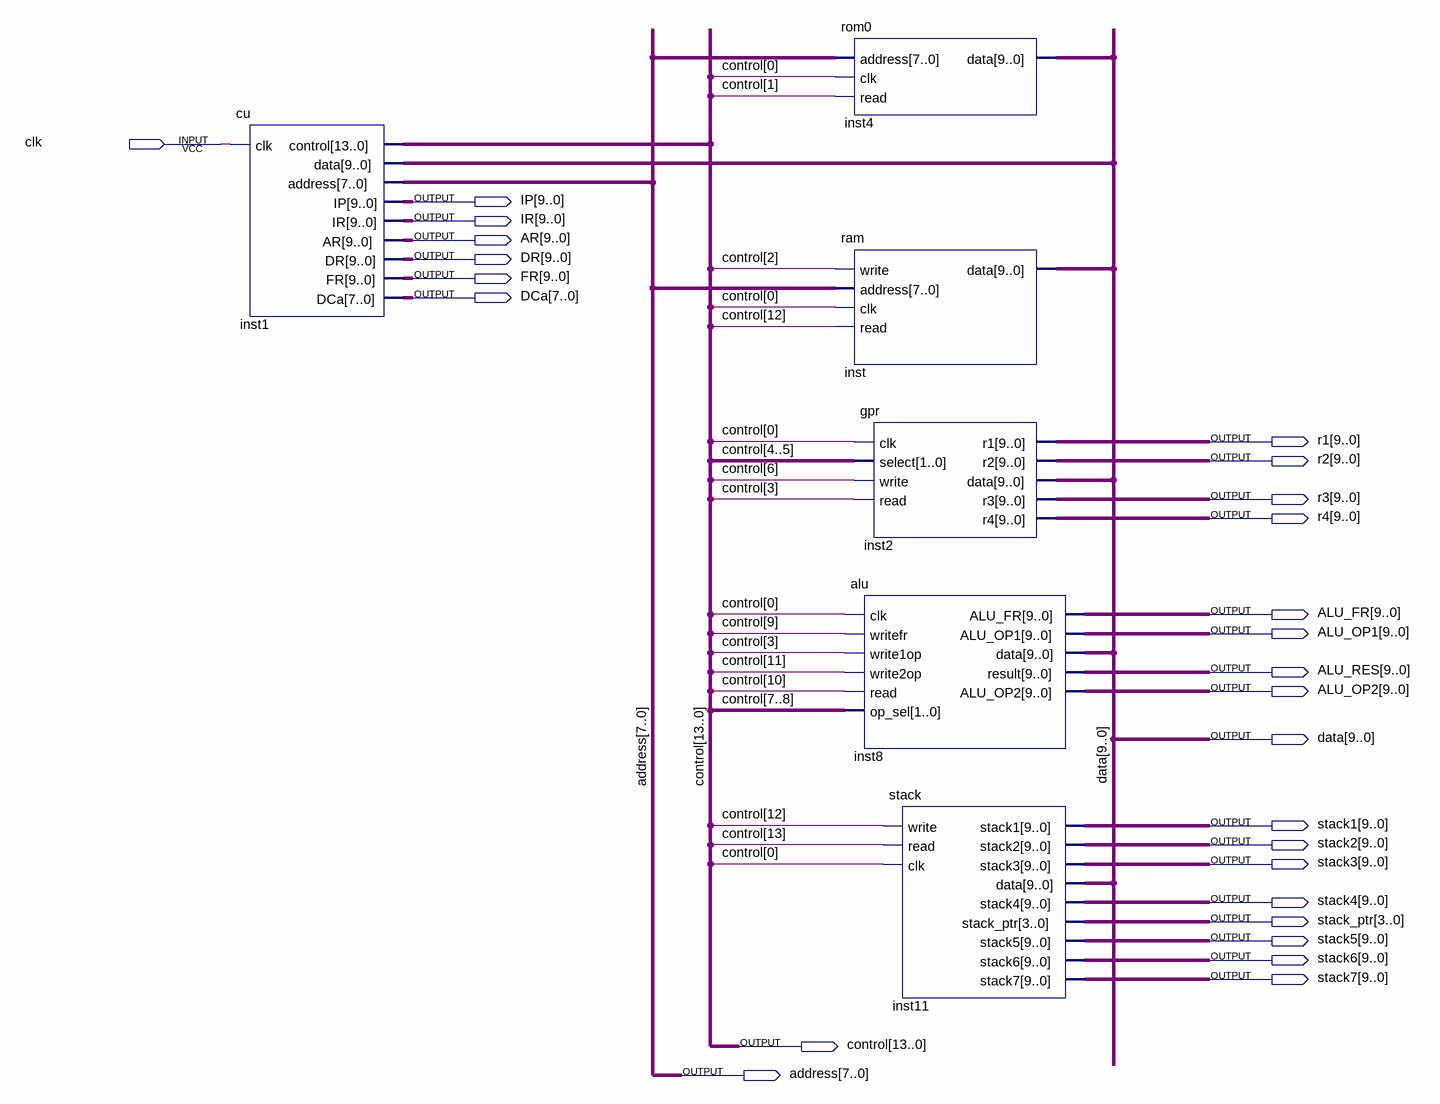
[diagram p0: schematic sheet]
// Quartus schematic Lab5.bdf as structural Verilog: 6 symbols, 26 pins
module Lab5 (
  input  clk,
  output [9:0] IP,
  output [9:0] IR,
  output [9:0] AR,
  output [9:0] DR,
  output [9:0] FR,
  output [7:0] DCa,
  output [9:0] r1,
  output [9:0] r2,
  output [9:0] r3,
  output [9:0] r4,
  output [9:0] ALU_FR,
  output [9:0] ALU_OP1,
  output [9:0] ALU_RES,
  output [9:0] ALU_OP2,
  output [9:0] data,
  output [9:0] stack1,
  output [9:0] stack2,
  output [9:0] stack3,
  output [9:0] stack4,
  output [3:0] stack_ptr,
  output [9:0] stack5,
  output [9:0] stack6,
  output [9:0] stack7,
  output [13:0] control,
  output [7:0] address
);

  cu inst1 (
    .clk(clk), .control(control), .address(address), .IP(IP), .IR(IR), .AR(AR), .DR(DR), .FR(FR), .DCa(DCa),
    .data(data));
  rom0 inst4 (.address(address), .clk(control[0]), .read(control[1]), .data(data));
  ram inst (.write(control[2]), .address(address), .clk(control[0]), .read(control[12]), .data(data));
  gpr inst2 (
    .clk(control[0]), .select({control[4], control[5]}), .write(control[6]), .read(control[3]), .r1(r1),
    .r2(r2), .r3(r3), .r4(r4), .data(data));
  alu inst8 (
    .clk(control[0]), .writefr(control[9]), .write1op(control[3]), .write2op(control[11]),
    .read(control[10]), .op_sel({control[7], control[8]}), .ALU_FR(ALU_FR), .ALU_OP1(ALU_OP1),
    .result(ALU_RES), .ALU_OP2(ALU_OP2), .data(data));
  stack inst11 (
    .write(control[12]), .read(control[13]), .clk(control[0]), .stack1(stack1), .stack2(stack2),
    .stack3(stack3), .stack4(stack4), .stack_ptr(stack_ptr), .stack5(stack5), .stack6(stack6),
    .stack7(stack7), .data(data));
endmodule
